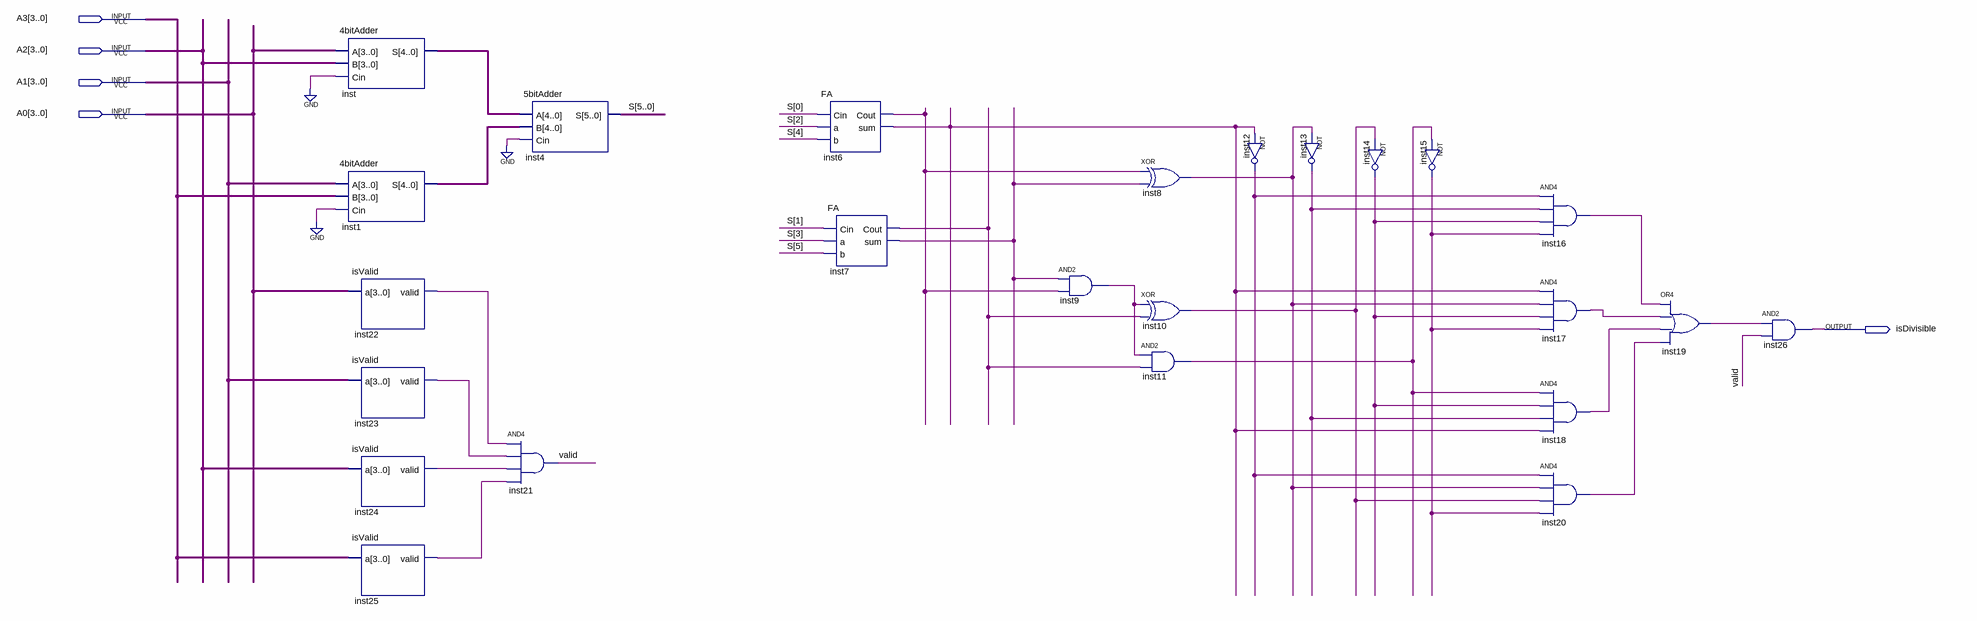
[diagram p0: schematic sheet]
// Quartus schematic div3.bdf as structural Verilog: 24 symbols, 5 pins
module div3 (
  input  [3:0] A3,
  input  [3:0] A2,
  input  [3:0] A1,
  input  [3:0] A0,
  output isDivisible
);

  wire inst6_cout, inst6_sum, inst7_cout, inst7_sum, inst8_out, inst9_out, inst10_out, inst11_out,
       inst12_out, inst13_out, inst14_out, inst15_out, inst16_out, inst17_out, inst18_out, inst19_out,
       inst20_out, inst22_valid, inst23_valid, inst24_valid, inst25_valid, valid;
  wire [4:0] inst1_s, inst_s;
  wire [5:0] S;

  \4bitAdder  inst (.A(A0), .B(A2), .Cin(1'b0), .S(inst_s));
  \4bitAdder  inst1 (.A(A1), .B(A3), .Cin(1'b0), .S(inst1_s));
  isValid inst22 (.a(A0), .valid(inst22_valid));
  isValid inst23 (.a(A1), .valid(inst23_valid));
  isValid inst24 (.a(A2), .valid(inst24_valid));
  isValid inst25 (.a(A3), .valid(inst25_valid));
  \5bitAdder  inst4 (.A(inst_s), .B(inst1_s), .Cin(1'b0), .S(S));
  and inst21 (valid, inst22_valid, inst23_valid, inst24_valid, inst25_valid);
  FA inst6 (.Cin(S[0]), .a(S[2]), .b(S[4]), .Cout(inst6_cout), .sum(inst6_sum));
  FA inst7 (.Cin(S[1]), .a(S[3]), .b(S[5]), .Cout(inst7_cout), .sum(inst7_sum));
  and inst9 (inst9_out, inst7_sum, inst6_cout);
  xor inst8 (inst8_out, inst6_cout, inst7_sum);
  xor inst10 (inst10_out, inst9_out, inst7_cout);
  and inst11 (inst11_out, inst9_out, inst7_cout);
  not inst12 (inst12_out, inst6_sum);
  not inst13 (inst13_out, inst8_out);
  not inst14 (inst14_out, inst10_out);
  not inst15 (inst15_out, inst11_out);
  and inst16 (inst16_out, inst12_out, inst13_out, inst14_out, inst15_out);
  and inst17 (inst17_out, inst6_sum, inst8_out, inst14_out, inst15_out);
  and inst18 (inst18_out, inst11_out, inst14_out, inst13_out, inst6_sum);
  and inst20 (inst20_out, inst12_out, inst8_out, inst10_out, inst15_out);
  or inst19 (inst19_out, inst16_out, inst17_out, inst18_out, inst20_out);
  and inst26 (isDivisible, inst19_out, valid);
endmodule
